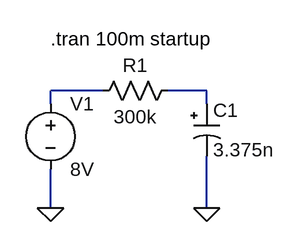
[diagram p0: schematic Draft2.asc]
Draft2.asc, the LTspice schematic file:
Version 4
SHEET 1 880 680
WIRE 160 96 96 96
WIRE 288 96 240 96
WIRE 96 112 96 96
WIRE 288 112 288 96
WIRE 96 240 96 192
WIRE 288 240 288 176
FLAG 96 240 0
FLAG 288 240 0
SYMBOL polcap 272 112 R0
SYMATTR InstName C1
SYMATTR Value 3.375n
SYMBOL voltage 96 96 R0
SYMATTR InstName V1
SYMATTR Value 8V
SYMBOL res 256 80 R90
WINDOW 0 0 56 VBottom 2
WINDOW 3 32 56 VTop 2
SYMATTR InstName R1
SYMATTR Value 300k
TEXT 96 32 Left 2 !.tran 100m startup

The netlist it stands for:
* Draft2.asc
C1 N002 0 3.375n
V1 N001 0 8V
R1 N002 N001 300k
.tran 100m startup
.backanno
.end